# Altium schematic sheet MISC_Protection.SchDoc
size A4
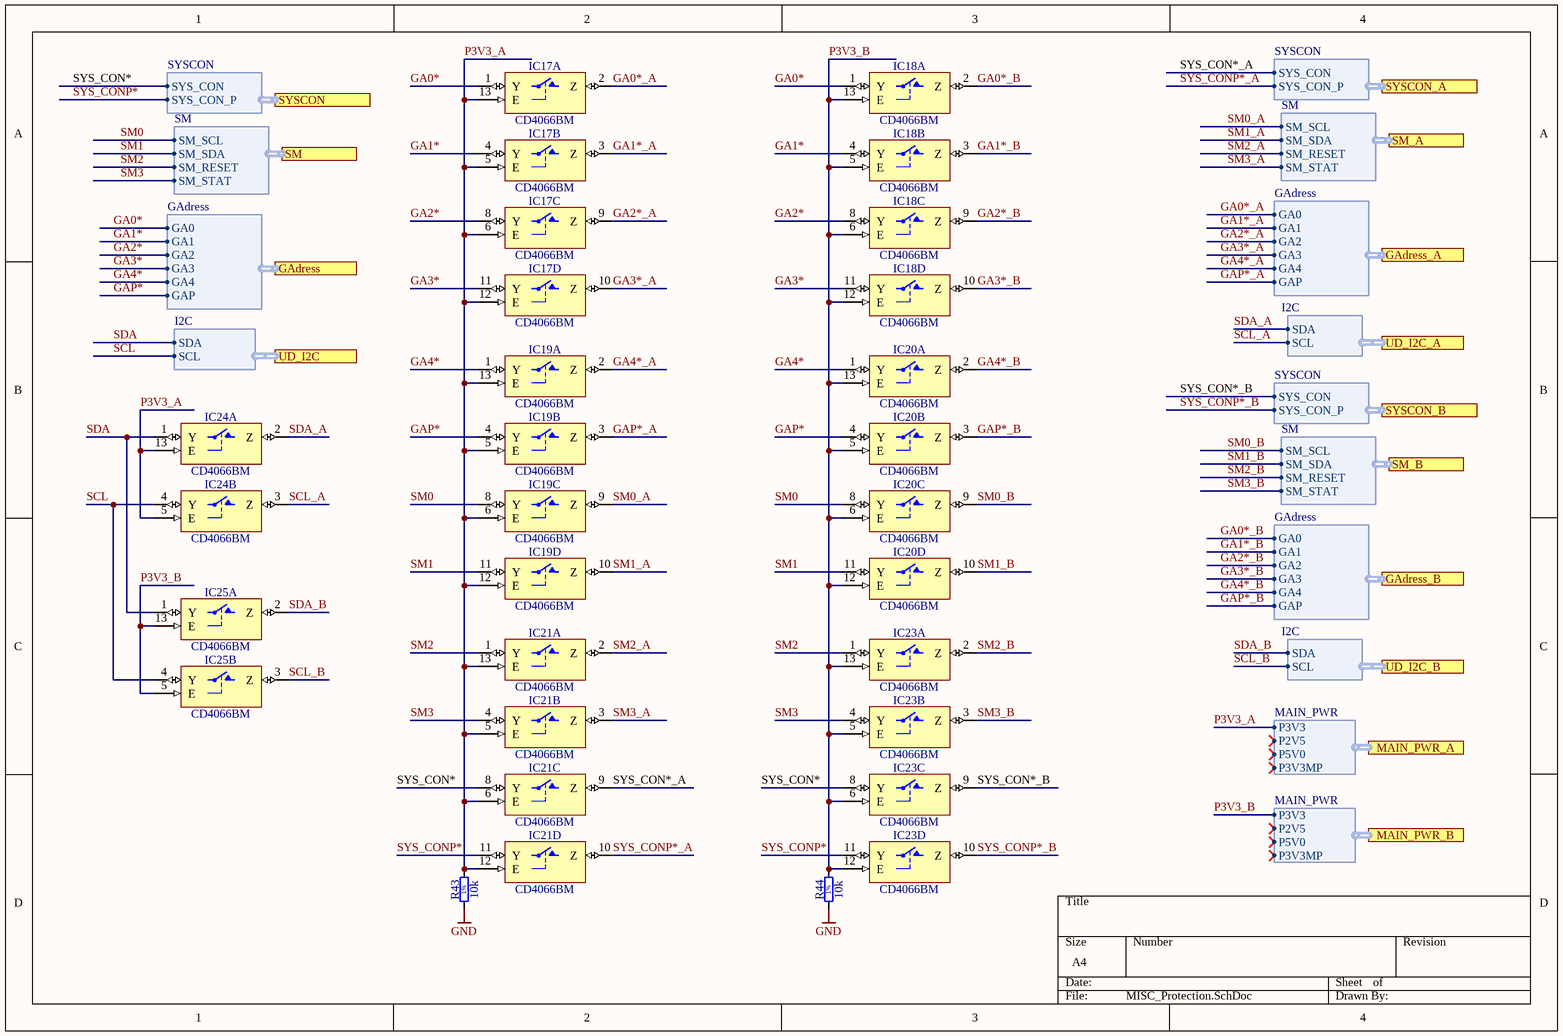
[diagram p0: MISC_Protection.SchDoc]

## Parts
IC17  CD4066BM  [SOIC127P600X175-14N]  (parts A,B,C,D of 4)
IC18  CD4066BM  [SOIC127P600X175-14N]  (parts A,B,C,D of 4)
IC19  CD4066BM  [SOIC127P600X175-14N]  (parts A,B,C,D of 4)
IC20  CD4066BM  [SOIC127P600X175-14N]  (parts A,B,C,D of 4)
IC21  CD4066BM  [SOIC127P600X175-14N]  (parts A,B,C,D of 4)
IC23  CD4066BM  [SOIC127P600X175-14N]  (parts A,B,C,D of 4)
IC24  CD4066BM  [SOIC127P600X175-14N]  (parts A,B of 4)
IC25  CD4066BM  [SOIC127P600X175-14N]  (parts A,B of 4)
R43  10k  [RESC1005X40N]
R44  10k  [RESC1005X40N]

## Ports
GAdress (harness GAdress), GAdress_A (harness GAdress), GAdress_B (harness GAdress), MAIN_PWR_A (harness MAIN_PWR), MAIN_PWR_B (harness MAIN_PWR), SM (harness SM), SM_A (harness SM), SM_B (harness SM), SYSCON (harness SYSCON), SYSCON_A (harness SYSCON), SYSCON_B (harness SYSCON), UD_I2C (harness I2C), UD_I2C_A (harness I2C), UD_I2C_B (harness I2C)

## Harnesses
SYSCON: SYS_CON, SYS_CON_P
SM: SM_SCL, SM_SDA, SM_RESET, SM_STAT
GAdress: GA0, GA1, GA2, GA3, GA4, GAP
MAIN_PWR: P3V3, P2V5, P5V0, P3V3MP
I2C: SDA, SCL

## Nets
GND: IC17.7(VSS) IC18.7(VSS) IC19.7(VSS) IC20.7(VSS) IC21.7(VSS) IC23.7(VSS) IC24.7(VSS) IC25.7(VSS) R43.1 R44.1
VDD: IC17.14(VDD) IC18.14(VDD) IC19.14(VDD) IC20.14(VDD) IC21.14(VDD) IC23.14(VDD) IC24.14(VDD) IC25.14(VDD)
GA0*: IC17.1(Y) IC18.1(Y) ; port GAdress.GA0
GA0*_A: IC17.2(Z) ; port GAdress_A.GA0
GA0*_B: IC18.2(Z) ; port GAdress_B.GA0
GA1*: IC17.4(Y) IC18.4(Y) ; port GAdress.GA1
GA1*_A: IC17.3(Z) ; port GAdress_A.GA1
GA1*_B: IC18.3(Z) ; port GAdress_B.GA1
GA2*: IC17.8(Y) IC18.8(Y) ; port GAdress.GA2
GA2*_A: IC17.9(Z) ; port GAdress_A.GA2
GA2*_B: IC18.9(Z) ; port GAdress_B.GA2
GA3*: IC17.11(Y) IC18.11(Y) ; port GAdress.GA3
GA3*_A: IC17.10(Z) ; port GAdress_A.GA3
GA3*_B: IC18.10(Z) ; port GAdress_B.GA3
GA4*: IC19.1(Y) IC20.1(Y) ; port GAdress.GA4
GA4*_A: IC19.2(Z) ; port GAdress_A.GA4
GA4*_B: IC20.2(Z) ; port GAdress_B.GA4
GAP*: IC19.4(Y) IC20.4(Y) ; port GAdress.GAP
GAP*_A: IC19.3(Z) ; port GAdress_A.GAP
GAP*_B: IC20.3(Z) ; port GAdress_B.GAP
P3V3_A: IC17.5(E) IC17.6(E) IC17.12(E) IC17.13(E) IC19.5(E) IC19.6(E) IC19.12(E) IC19.13(E) IC21.5(E) IC21.6(E) IC21.12(E) IC21.13(E) IC24.5(E) IC24.13(E) R43.2 ; port MAIN_PWR_A.P3V3
P3V3_B: IC18.5(E) IC18.6(E) IC18.12(E) IC18.13(E) IC20.5(E) IC20.6(E) IC20.12(E) IC20.13(E) IC23.5(E) IC23.6(E) IC23.12(E) IC23.13(E) IC25.5(E) IC25.13(E) R44.2 ; port MAIN_PWR_B.P3V3
SCL: IC24.4(Y) IC25.4(Y) ; port UD_I2C.SCL
SCL_A: IC24.3(Z) ; port UD_I2C_A.SCL
SCL_B: IC25.3(Z) ; port UD_I2C_B.SCL
SDA: IC24.1(Y) IC25.1(Y) ; port UD_I2C.SDA
SDA_A: IC24.2(Z) ; port UD_I2C_A.SDA
SDA_B: IC25.2(Z) ; port UD_I2C_B.SDA
SM0: IC19.8(Y) IC20.8(Y) ; port SM.SM_SCL
SM0_A: IC19.9(Z) ; port SM_A.SM_SCL
SM0_B: IC20.9(Z) ; port SM_B.SM_SCL
SM1: IC19.11(Y) IC20.11(Y) ; port SM.SM_SDA
SM1_A: IC19.10(Z) ; port SM_A.SM_SDA
SM1_B: IC20.10(Z) ; port SM_B.SM_SDA
SM2: IC21.1(Y) IC23.1(Y) ; port SM.SM_RESET
SM2_A: IC21.2(Z) ; port SM_A.SM_RESET
SM2_B: IC23.2(Z) ; port SM_B.SM_RESET
SM3: IC21.4(Y) IC23.4(Y) ; port SM.SM_STAT
SM3_A: IC21.3(Z) ; port SM_A.SM_STAT
SM3_B: IC23.3(Z) ; port SM_B.SM_STAT
SYS_CON*: IC21.8(Y) IC23.8(Y) ; port SYSCON.SYS_CON
SYS_CON*_A: IC21.9(Z) ; port SYSCON_A.SYS_CON
SYS_CON*_B: IC23.9(Z) ; port SYSCON_B.SYS_CON
SYS_CONP*: IC21.11(Y) IC23.11(Y) ; port SYSCON.SYS_CON_P
SYS_CONP*_A: IC21.10(Z) ; port SYSCON_A.SYS_CON_P
SYS_CONP*_B: IC23.10(Z) ; port SYSCON_B.SYS_CON_P

## Notes on the sheet
- (in symbol R0402_10K_1%_0.0625W_100PPM) 1%

## Library data of the parts
IC17-IC21 IC23-IC25 = CD4066BM: Part Description: CMOS Quad Bilateral Switch; Manufacturer: TEXAS INSTRUMENTS; PressFit: No; Bonding: No; Part Number: CD4066BM; Component Kind: Standard; Component Type: Standard; Device: CD4066BM; PackageDescription: SOIC 14, Pitch 1.27mm - Body 4x8.75mm, IPC Medium Density; Manufacturer Part Number: CD4066BM; Pin Count: 14; Case: SOIC14; Mounted: Yes; Socket: No; SMD: Yes; Sense: No; ComponentHeight: 1.75mm; Author: CERN DEM MR; HelpURL: \\cern.ch\dfs\Applications\Altium\Datasheets\CD4066BM.pdf; CreateDate: 21.01.2016; LatestRevisionDate: 21.01.2016
R43 R44 = R0402_10K_1%_0.0625W_100PPM: Resistor - 1%; Part Description: General Purpose Thick Film Chip Resistor; Manufacturer: GENERIC; Manufacturer1 Part Number: 232270671003L; TC: ±100ppm/°C; PressFit: No; Part Number: R0402_10K_1%_0.0625W_100PPM; Component Kind: Standard; Component Type: Standard; Pin Count: 2; Value: 10k; Status: Not Recommended; Power: 0.0625W; Tolerance: ±1%; Manufacturer Part Number: R0402_10K_1%_0.0625W_100PPM; Case: 0402; Mounted: Yes; Sense: No; Socket: No; SMD: Yes; Manufacturer1 Example: YAGEO PHYCOMP; Manufacturer1 ComponentHeight: 0.4mm; HelpURL: \\cern.ch\dfs\Applications\Altium\Datasheets\R0402_Phycomp_RC0402.pdf; Author: CERN DEM JLC; CreateDate: 03/12/2007; LatestRevisionDate: 17/10/2012